# Altium project TPS40304_DEMO.PrjPcb
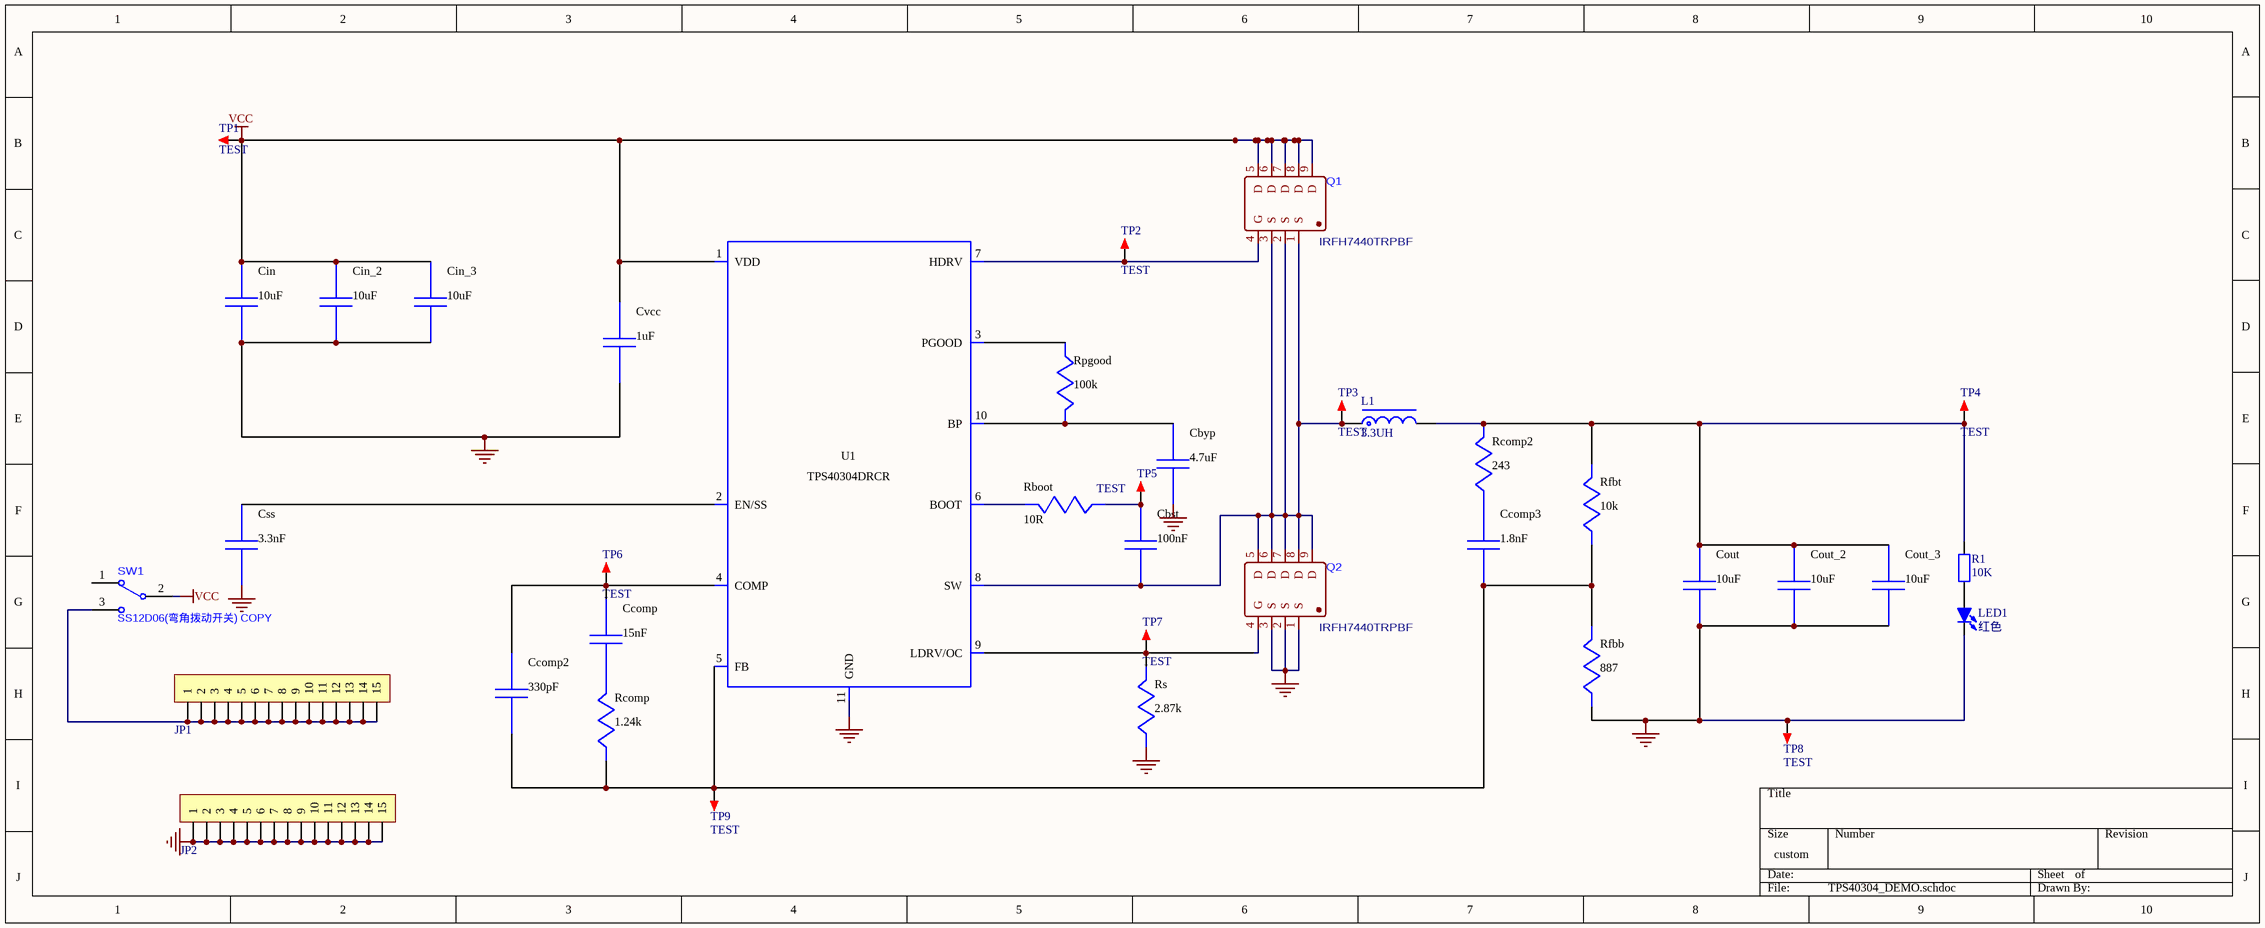
[diagram p0: TPS40304_DEMO.schdoc]
1 sheet, 38 parts. Net scope: global (net labels, ports and power ports of the same name join across sheets).
Board file: TPS40304_DEMO.PcbDoc

## Sheet TPS40304_DEMO.schdoc
size 424 x 172 mm; SheetNumber: 1; SheetTotal: 1

### Parts
Cbst  value 100nF  [C 0805_L]  (hidden comment: GRM155R71C104KA88D)
Cbyp  value 4.7uF  [C 0805_L]  (hidden comment: LMK212BJ475KD-T)
Ccomp  value 15nF  [C 0805_L]  (hidden comment: CGA4F2C0G1H153J085AA)
Ccomp2  value 330pF  [C 0805_L]  (hidden comment: CL21C331JBANNNC)
Ccomp3  value 1.8nF  [C 0805_L]  (hidden comment: C2012C0G1H182K060AA)
Cin  value 10uF  [C 1210_L]  (hidden comment: C3225X7R1H106M250AC)
Cin_2  value 10uF  [C 1210_L]  (hidden comment: C3225X7R1H106M250AC)
Cin_3  value 10uF  [C 1206_L]  (hidden comment: C3225X7R1H106M250AC)
Cout  value 10uF  [C 1210_L]  (hidden comment: CL32B106KBJNNWE)
Cout_2  value 10uF  [C 1210_L]  (hidden comment: CL32B106KBJNNWE)
Cout_3  value 10uF  [C 1206_L]  (hidden comment: CL32B106KBJNNWE)
Css  value 3.3nF  [C 0805_L]  (hidden comment: GRM033R71A332KA01D)
Cvcc  value 1uF  [C 0805_L]  (hidden comment: TMK212B7105KG-T)
JP1  HDR-1X15  [HDR2.54-LI-15P]  (value not drawn)
JP2  HDR-1X15  [HDR2.54-LI-15P]  (value not drawn)
L1  3.3UH  [SMD-L-1770]
LED1  红色  [LED 0805G]
Q1  IRFH7440TRPBF  [PQFN-8P_L5.8-W4.9-P1.27-LS6.0-BL]
Q2  IRFH7440TRPBF  [PQFN-8P_L5.8-W4.9-P1.27-LS6.0-BL]
R1  10K  [R 0805_L]
Rboot  value 10R  [R 0805_L]  (hidden comment: CRCW04022K87FKED)
Rcomp  value 1.24k  [R 0805_L]  (hidden comment: CRCW04021K24FKED)
Rcomp2  value 243  [R 0805_L]  (hidden comment: CRCW0402243RFKED)
Rfbb  value 887  [R 0805_L]  (hidden comment: CRCW0402887RFKED)
Rfbt  value 10k  [R 0805_L]  (hidden comment: RC0201FR-0710KL)
Rpgood  value 100k  [R 0805_L]  (hidden comment: CRCW0402100KFKED)
Rs  value 2.87k  [R 0805_L]  (hidden comment: CRCW04022K87FKED)
SW1  SS12D06(弯角拨动开关) COPY  [SS12_d06]
TP1  TEST  [TEST 1.6]
TP2  TEST  [TEST 1.6]
TP3  TEST  [TEST 1.6]
TP4  TEST  [TEST 1.6]
TP5  TEST  [TEST 1.6]
TP6  TEST  [TEST 1.6]
TP7  TEST  [TEST 1.6]
TP8  TEST  [TEST 1.6]
TP9  TEST  [TEST 1.6]
U1  TPS40304DRCR  [WSON-10_L3.0-W3.0-P0.50-TL-EP]

### Nets
0: Cbyp.2 Cin.2 Cin_2.2 Cin_3.2 Cout.2 Cout_2.2 Cout_3.2 Css.2 Cvcc.2 JP2.1 JP2.2 JP2.3 JP2.4 JP2.5 JP2.6 JP2.7 JP2.8 JP2.9 JP2.10 JP2.11 JP2.12 JP2.13 JP2.14 JP2.15 LED1.2(K) Q2.1(S) Q2.2(S) Q2.3(S) Rfbb.2 Rs.2 TP8.1 U1.11(GND)
VCC: Cin.1 Cin_2.1 Cin_3.1 Cvcc.1 Q1.5(D) Q1.6(D) Q1.7(D) Q1.8(D) Q1.9(D) SW1.2 TP1.1 U1.1(VDD)
NetCbst_1: Cbst.1 Rboot.2 TP5.1
NetCbst_2: Cbst.2 L1.1 Q1.1(S) Q1.2(S) Q1.3(S) Q2.5(D) Q2.6(D) Q2.7(D) Q2.8(D) Q2.9(D) TP3.1 U1.8(SW)
NetCbyp_1: Cbyp.1 Rpgood.1 U1.10(BP)
NetCcomp2_1: Ccomp2.1 Ccomp3.2 Rcomp.2 Rfbb.1 Rfbt.2 TP9.1 U1.5(FB)
NetCcomp3_1: Ccomp3.1 Rcomp2.2
NetCcomp_1: Ccomp.1 Rcomp.1
NetCcomp_2: Ccomp.2 Ccomp2.2 TP6.1 U1.4(COMP)
NetCout_1: Cout.1 Cout_2.1 Cout_3.1 L1.2 R1.1 Rcomp2.1 Rfbt.1 TP4.1
NetCss_1: Css.1 U1.2(EN/SS)
NetJP1_1: JP1.1 JP1.2 JP1.3 JP1.4 JP1.5 JP1.6 JP1.7 JP1.8 JP1.9 JP1.10 JP1.11 JP1.12 JP1.13 JP1.14 JP1.15 SW1.3
NetLED1_1: LED1.1(A) R1.2
NetQ1_4: Q1.4(G) TP2.1 U1.7(HDRV)
NetQ2_4: Q2.4(G) Rs.1 TP7.1 U1.9(LDRV/OC)
NetRboot_1: Rboot.1 U1.6(BOOT)
NetRpgood_2: Rpgood.2 U1.3(PGOOD)

Not connected (* = marked no-connect by the designer): SW1 1

### Library data of the parts
Cbst = GRM155R71C104KA88D: GRM155R71C104KA8; Manufacturer Name: MuRata; PackageReference: GRM155R71C104KA88D; Manufacturer Part Number: GRM155R71C104KA88D
Cbyp = LMK212BJ475KD-T: Manufacturer Name: Taiyo Yuden; PackageReference: LMK212BJ475KD-T; Manufacturer Part Number: LMK212BJ475KD-T
Ccomp = CGA4F2C0G1H153J085AA: CGA4F2C0G1H153J0; Manufacturer Name: TDK; PackageReference: CGA4F2C0G1H153J085AA; Manufacturer Part Number: CGA4F2C0G1H153J085AA
Ccomp2 = CL21C331JBANNNC: Manufacturer Name: Samsung Electro-Mechanics; PackageReference: CL21C331JBANNNC; Manufacturer Part Number: CL21C331JBANNNC
Ccomp3 = C2012C0G1H182K060AA: C2012C0G1H182K06; Manufacturer Name: TDK; PackageReference: C2012C0G1H182K060AA; Manufacturer Part Number: C2012C0G1H182K060AA
Cin Cin_2 Cin_3 = C3225X7R1H106M250AC: C3225X7R1H106M25; Manufacturer Name: TDK; PackageReference: C3225X7R1H106M250AC; Manufacturer Part Number: C3225X7R1H106M250AC
Cout Cout_2 Cout_3 = CL32B106KBJNNWE: Manufacturer Name: Samsung Electro-Mechanics; PackageReference: CL32B106KBJNNWE; Manufacturer Part Number: CL32B106KBJNNWE
Css = GRM033R71A332KA01D: GRM033R71A332KA0; Manufacturer Name: MuRata; PackageReference: GRM033R71A332KA01D; Manufacturer Part Number: GRM033R71A332KA01D
Cvcc = TMK212B7105KG-T: Manufacturer Name: Taiyo Yuden; PackageReference: TMK212B7105KG-T; Manufacturer Part Number: TMK212B7105KG-T
JP1 JP2 = Header 15: 15P接插件; 版权归属: 源创客; BOM名称: 15P接插件; 学习资源: www.ooocke.com
L1 = L-CD: 贴片功率电感; BOM名称: 功率电感; 版权归属: 源创客; 学习资源: www.ooocke.com
LED1 = LED-SMD: 贴片LED; 版权归属: 源创客; BOM名称: 贴片LED; 学习资源: www.ooocke.com
R1 = R: 贴片电阻; 版权归属: 源创客; BOM名称: 贴片电阻; 学习资源: www.ooocke.com
Rboot Rs = CRCW04022K87FKED: Manufacturer Name: Vishay-Dale; PackageReference: CRCW04022K87FKED; Manufacturer Part Number: CRCW04022K87FKED
Rcomp = CRCW04021K24FKED: Manufacturer Name: Vishay-Dale; PackageReference: CRCW04021K24FKED; Manufacturer Part Number: CRCW04021K24FKED
Rcomp2 = CRCW0402243RFKED: Manufacturer Name: Vishay-Dale; PackageReference: CRCW0402243RFKED; Manufacturer Part Number: CRCW0402243RFKED
Rfbb = CRCW0402887RFKED: Manufacturer Name: Vishay-Dale; PackageReference: CRCW0402887RFKED; Manufacturer Part Number: CRCW0402887RFKED
Rfbt = RC0201FR-0710KL: Manufacturer Name: Yageo; PackageReference: RC0201FR-0710KL; Manufacturer Part Number: RC0201FR-0710KL
Rpgood = CRCW0402100KFKED: Manufacturer Name: Vishay-Dale; PackageReference: CRCW0402100KFKED; Manufacturer Part Number: CRCW0402100KFKED
TP1-TP9 = TEST: 测试点; 版权归属: 源创客; BOM名称: 测试点; 学习资源: www.ooocke.com
U1 = TPS40304DRCR: Manufacturer Name: Texas Instruments; PackageReference: TPS40304DRCR; Manufacturer Part Number: TPS40304DRCR; Value: N/A